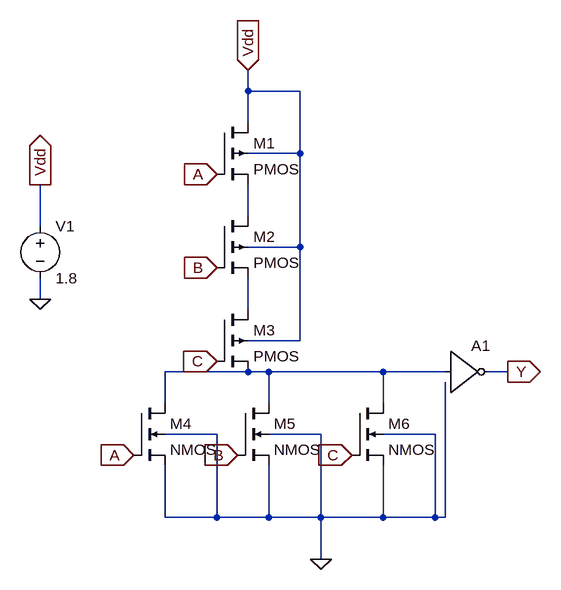
[diagram p0: schematic OR3.asc]
OR3.asc, the LTspice schematic file:
Version 4
SHEET 1 880 692
WIRE 112 -48 112 -80
WIRE 192 -48 112 -48
WIRE 112 0 112 -48
WIRE 192 48 192 -48
WIRE 192 48 112 48
WIRE 112 144 112 96
WIRE -208 160 -208 96
WIRE 192 192 192 48
WIRE 192 192 112 192
WIRE -208 272 -208 240
WIRE 112 288 112 240
WIRE 192 336 192 192
WIRE 192 336 112 336
WIRE 112 384 -16 384
WIRE 144 384 112 384
WIRE 320 384 144 384
WIRE 416 384 320 384
WIRE 512 384 480 384
WIRE -16 432 -16 384
WIRE 144 432 144 384
WIRE 320 432 320 384
WIRE 64 480 -16 480
WIRE 224 480 144 480
WIRE 400 480 320 480
WIRE -16 608 -16 528
WIRE 64 608 64 480
WIRE 64 608 -16 608
WIRE 144 608 144 528
WIRE 144 608 64 608
WIRE 224 608 224 480
WIRE 224 608 144 608
WIRE 320 608 320 528
WIRE 320 608 224 608
WIRE 400 608 400 480
WIRE 400 608 320 608
WIRE 416 608 416 400
WIRE 416 608 400 608
WIRE 224 672 224 608
FLAG 64 80 A
IOPIN 64 80 In
FLAG -64 512 A
IOPIN -64 512 In
FLAG 64 224 B
IOPIN 64 224 In
FLAG 96 512 B
IOPIN 96 512 In
FLAG 64 368 C
IOPIN 64 368 In
FLAG 272 512 C
IOPIN 272 512 In
FLAG 224 672 0
FLAG 512 384 Y
IOPIN 512 384 Out
FLAG -208 272 0
FLAG -208 96 Vdd
IOPIN -208 96 Out
FLAG 112 -80 Vdd
IOPIN 112 -80 In
SYMBOL pmos4 64 0 R0
SYMATTR InstName M1
SYMBOL pmos4 64 144 R0
SYMATTR InstName M2
SYMATTR Value2 l=180n
SYMBOL pmos4 64 288 R0
SYMATTR InstName M3
SYMATTR Value2 l=180n
SYMBOL nmos4 -64 432 R0
SYMATTR InstName M4
SYMATTR Value2 l=180n
SYMBOL nmos4 96 432 R0
SYMATTR InstName M5
SYMATTR Value2 l=180n
SYMBOL nmos4 272 432 R0
SYMATTR InstName M6
SYMATTR Value2 l=180n
SYMBOL voltage -208 144 R0
WINDOW 123 0 0 Left 0
WINDOW 39 0 0 Left 0
SYMATTR InstName V1
SYMATTR Value 1.8
SYMBOL Digital\\inv 416 320 R0
SYMATTR InstName A1

The netlist it stands for:
* OR3.asc
M1 Vdd A N001 Vdd PMOS
M2 N001 B N002 Vdd PMOS l=180n
M3 N002 C N003 Vdd PMOS l=180n
M4 N003 A 0 0 NMOS l=180n
M5 N003 B 0 0 NMOS l=180n
M6 N003 C 0 0 NMOS l=180n
V1 Vdd 0 1.8
A1 N003 0 0 0 0 Y 0 0 BUF
.model NMOS NMOS
.model PMOS PMOS
.lib standard.mos
.backanno
.end